# Altium schematic sheet Sensor.SchDoc
size 297 x 209 mm; CompanyName: Sainsbury Wellcome Centre; Organization: FabLab; Address1: Sainsbury Wellcome Centre; Address2: 25 Howland Street; Address3: London; Address4: W1T 4JG; DocumentNumber: 3; SheetNumber: 4; SheetTotal: 5; swcgroup: FabLab; Org: Sainsbury Wellcome Centre; Add1: 25 Howland Street; Add2: London; Add3: W1T 4JG; WebAddress: www.sainsburywellcome.org; SheetSize: A4; SheetName: Sensor
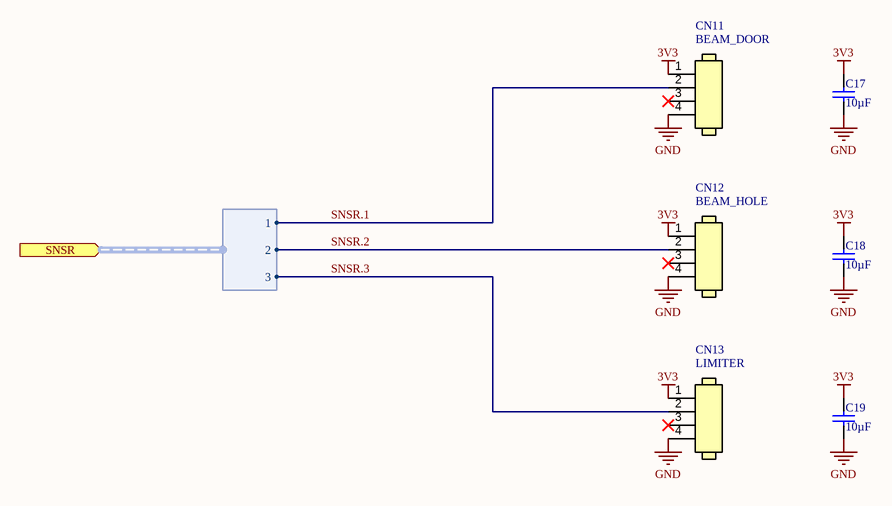
[diagram p0: Sensor.SchDoc]

## Parts
C17  value 10µF  [CAP_CHIP_0603]  (hidden comment: C0603-10uF-25V)
C18  value 10µF  [CAP_CHIP_0603]  (hidden comment: C0603-10uF-25V)
C19  value 10µF  [CAP_CHIP_0603]  (hidden comment: C0603-10uF-25V)
CN11  BEAM_DOOR  [MOLEX_1.25_R_DIP_4P]
CN12  BEAM_HOLE  [MOLEX_1.25_R_DIP_4P]
CN13  LIMITER  [MOLEX_1.25_R_DIP_4P]

## Ports
SNSR (in, harness SNSR)

## Harnesses
SNSR: 3, 2, 1

## Nets
3V3: C17.2 C18.2 C19.2 CN11.1 CN12.1 CN13.1
GND: C17.1 C18.1 C19.1 CN11.4 CN12.4 CN13.4
SNSR.1: CN11.2 ; port SNSR.1
SNSR.2: CN12.2 ; port SNSR.2
SNSR.3: CN13.2 ; port SNSR.3

Not connected (* = marked no-connect by the designer): CN11 3*; CN12 3*; CN13 3*

## Notes on the sheet
- FILE
- VARIANT
- DATE
- REVISION
- SHEET
- /
- PROJECT
- SIZE

## Library data of the parts
C17-C19 = CMP-611-0050-6: 0603 Multilayer Ceramic Capacitors MLCC; PartNumber: CL10A106MA8NRNC; Dielectric: X5R; Pick&PlaceFootprint: C0603; Voltage Rating: 25V; Tolerance: 20%; Case/Package: 0603; LCSC Part N.: C96446; RoHS: Yes; Capacitor Type: Ceramic; Mount: SMD
CN11-CN13 = CMP-370-0050-2: Conn Shrouded Header (4 Sides) HDR 4 POS 1.25mm Solder RA Side Entry Thru-Hole PicoBlade™ Tray; PartNumber: 53048-0410; Number of Contacts: 4; Current Rating: 1A; Gender: Male; Pitch: 1.25mm; Orientation: Right Angle; Number of Rows: 1; Mount: Surface Mount; LCSC Part N.: C588275